# Altium project 12V_IdealDiode_PowerSupply_v1.PrjPcb
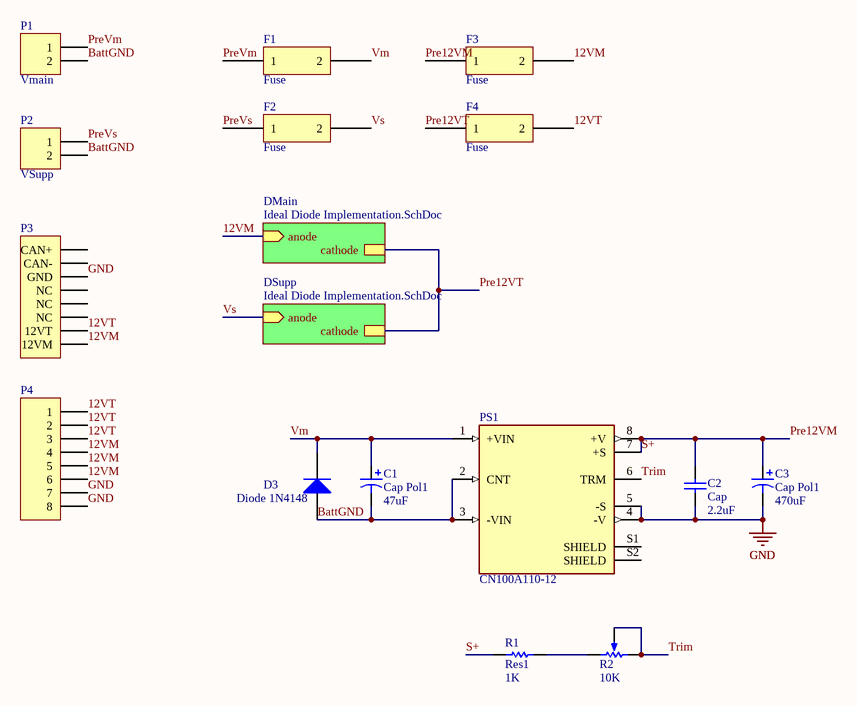
[diagram p0: 12V_IdealDiode_PowerSupply_v1.SchDoc]
2 sheets, 25 parts. Net scope: hierarchical (ports join the sheet entries above them; power ports are global).
Board file: 12V_IdealDiode_PowerSupply_v1.PcbDoc
Sheets:
  12V_IdealDiode_PowerSupply_v1.SchDoc
    DMain = Ideal Diode Implementation.SchDoc
    DSupp = Ideal Diode Implementation.SchDoc

## Sheet 12V_IdealDiode_PowerSupply_v1.SchDoc
size A; SheetNumber: 1; SheetTotal: 2

### Parts
C1  Cap Pol1  value 47uF  [RB7.6-15]
C2  Cap  value 2.2uF  [RAD-0.3]
C3  Cap Pol1  value 470uF  [RB7.6-15]
D3  Diode 1N4148  [DO-35]
F1  Fuse  [Fuse Hilder]
F2  Fuse  [Fuse Hilder]
F3  Fuse  [Fuse Hilder]
F4  Fuse  [Fuse Hilder]
P1  Vmain  [HDR1X2H]
P2  VSupp  [HDR1X2H]
P3  Header 8  [HDR1X8]  (value not drawn)
P4  Header 8  [HDR1X8]  (value not drawn)
PS1  CN100A110-12  [CONV_CN100A110-12]
R1  Res1  value 1K  [AXIAL-0.3]
R2  value 10K  [POT OFFSET 100_1]  (hidden comment: RPot_2)

### Sub-sheets
DMain = Ideal Diode Implementation.SchDoc: anode (in), cathode
DSupp = Ideal Diode Implementation.SchDoc: anode (in), cathode

### Nets
GND: C2.1 C3.2 P3.3(GND) P4.7 P4.8 PS1.4(-V) PS1.5(-S)
12VM: F3.2 P3.8(12VM) P4.4 P4.5 P4.6 ; sheet DMain/anode
12VT: F4.2 P3.7(12VT) P4.1 P4.2 P4.3
BattGND: C1.2 D3.1(A) P1.2 P2.2 PS1.2(CNT) PS1.3(-VIN)
Pre12VM: C2.2 C3.1 F3.1 PS1.7(+S) PS1.8(+V) R1.1  [also labelled S+]
Pre12VT: F4.1 ; sheet DMain/cathode, sheet DSupp/cathode
PreVm: F1.1 P1.1
PreVs: F2.1 P2.1
Trim: PS1.6(TRM) R2.1(TOP) R2.2(TAP)
Vm: C1.1 D3.2(K) F1.2 PS1.1(+VIN)
Vs: F2.2 ; sheet DSupp/anode
NetR1_2: R1.2 R2.3(BOT)

Not connected (* = marked no-connect by the designer): P3 1(CAN+) 2(CAN-) 4(NC) 5(NC) 6(NC); PS1 S1(SHIELD) S2(SHIELD)

### Library data of the parts
C1 C3 = Cap Pol1: Polarized Capacitor (Radial); Published: 8-Jun-2000; LatestRevisionDate: 17-Jul-2002; LatestRevisionNote: Re-released for DXP Platform.; PackageReference: RB7.6-15; Publisher: Altium Limited; PackageDescription: Polarized Capacitor (Radial); 2 Leads
C2 = Cap: Ceramic Capacitor; Published: 8-Jun-2000; LatestRevisionDate: 17-Jul-2002; LatestRevisionNote: Re-released for DXP Platform.; PackageReference: RAD-0.3; Publisher: Altium Limited; PackageDescription: Radial Cap, Thru-Hole; 2 Leads; 0.3 in Pin Spacing
D3 = Diode 1N4148: High Conductance Fast Diode; Published: 8-Jun-2000; LatestRevisionDate: 17-Jul-2002; LatestRevisionNote: Re-released for DXP Platform.; DatasheetVersion: 1997; PackageReference: DO-35; Publisher: Altium Limited; PackageDescription: Diode, Axial; Body 3.8 x 1.9 mm (LxDia. max), Lead Dia. 0.53 mm (max); Code_JEDEC: DO-204-AH; ComponentLink1Description: Manufacturer Link; ComponentLink1URL: http://www.fairchildsemi.com/; ComponentLink2Description: Datasheet; ComponentLink2URL: http://www.fairchildsemi.com/ds/1N%2F1N4148.pdf
P1 P2 = Header 2H: Header, 2-Pin, Right Angle; LatestRevisionDate: 17-Jul-2002; LatestRevisionNote: Re-released for DXP Platform.; Publisher: Altium Limited
P3 P4 = Header 8: Header, 8-Pin; LatestRevisionDate: 17-Jul-2002; LatestRevisionNote: Re-released for DXP Platform.; Publisher: Altium Limited
PS1 = CN100A110-12: Isolated Module DC DC Converter 1 Output 12V - - 8.4A 60V - 160V Input; MF: TDK-Lambda Americas Inc; Price: None; Availability: In Stock; Check_prices: https://www.snapeda.com/parts/CN100A110-12/TDK-Lambda+Americas+Inc/view-part/?ref=eda; Value: *; MP: CN100A110-12; Package: DIP-9 TDK-Lambda Americas Inc; Purchase-URL: https://pricing.snapeda.com/search/part/CN100A110-12/?ref=eda; SnapEDA_Link: https://www.snapeda.com/parts/CN100A110-12/TDK-Lambda+Americas+Inc/view-part/?ref=snap
R1 = Res1: Resistor; Published: 8-Jun-2000; LatestRevisionDate: 17-Jul-2002; LatestRevisionNote: Re-released for DXP Platform.; PackageReference: AXIAL-0.3; Publisher: Altium Limited; PackageDescription: Axial Device, Thru-Hole; 2 Leads; 0.3 in Pin Spacing
R2 = RPot_5: Potentiometer; Sim Note: Enter the Resistance value and the set point into parameter fields.; Set Position: 0.5; Published: 8-Jun-2000; LatestRevisionDate: 17-Jul-2002; LatestRevisionNote: Re-released for DXP Platform.; PackageReference: VR5; Publisher: Altium Limited; PackageDescription: Variable Resistor, Thru-Hole; 3 Leads

## Sheet Ideal Diode Implementation.SchDoc
size A; SheetNumber: 2; SheetTotal: 2
Used 2 times, as channels DMain, DSupp. Parts and nets are listed once, with the designators drawn on the sheet.
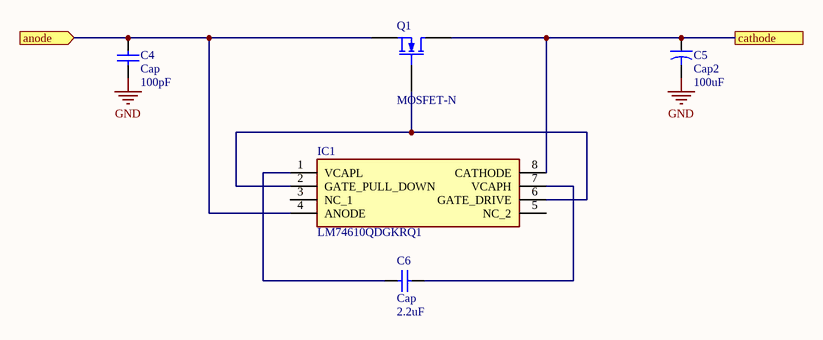
[diagram p1: Ideal Diode Implementation.SchDoc]

### Parts
C4  Cap  value 100pF  [RAD-0.3]
C5  Cap2  value 100uF  [CAPR5-4X5]
C6  Cap  value 2.2uF  [RAD-0.3]
IC1  LM74610QDGKRQ1  [SOP65P490X110-8N]
Q1  MOSFET-N  [E3]

### Ports
anode (in), cathode

### Nets
GND: C4.1 C5.2
anode: C4.2 IC1.4(ANODE) Q1.3(S) ; port anode
cathode: C5.1 IC1.8(CATHODE) Q1.1(D) ; port cathode
NetC6_1: C6.1 IC1.1(VCAPL)
NetC6_2: C6.2 IC1.7(VCAPH)
NetIC1_2: IC1.2(GATE_PULL_DOWN) IC1.6(GATE_DRIVE) Q1.2(G)

Not connected (* = marked no-connect by the designer): IC1 3(NC_1) 5(NC_2)

### Channels
DMain: designators end in _DMain; ports anode=12VM cathode=Pre12VT
DSupp: designators end in _DSupp; ports anode=Vs cathode=Pre12VT

### Library data of the parts
C4 C6 = Cap: Capacitor; Published: 8-Jun-2000; LatestRevisionDate: 17-Jul-2002; LatestRevisionNote: Re-released for DXP Platform.; PackageReference: RAD-0.3; Publisher: Altium Limited; PackageDescription: Radial Cap, Thru-Hole; 2 Leads; 0.3 in Pin Spacing
C5 = Cap2: Capacitor; Published: 23-Sep-2002; PackageReference: CAPR5-4X5; Publisher: Altium Limited; PackageDescription: Capacitor; 2 Leads
IC1 = LM74610QDGKRQ1: Integrated Circuit; Manufacturer_Name: Texas Instruments; Datasheet Link: http://www.ti.com/lit/gpn/lm74610-q1; Height: 1.1mm; Manufacturer_Part_Number: LM74610QDGKRQ1; Mouser Part Number: 595-LM74610QDGKRQ1; Mouser Price/Stock: https://www.mouser.co.uk/ProductDetail/Texas-Instruments/LM74610QDGKRQ1?qs=3jdCaFhktOQTVpuuubgDqg%3D%3D; Arrow Part Number: LM74610QDGKRQ1; Arrow Price/Stock: https://www.arrow.com/en/products/lm74610qdgkrq1/texas-instruments
Q1 = MOSFET-N: N-Channel MOSFET; Published: 8-Jun-2000; LatestRevisionDate: 17-Jul-2002; LatestRevisionNote: Re-released for DXP Platform.; PackageVersion: 1995/1996; PackageReference: E3; Publisher: Altium Limited; PackageDescription: TO, Flat Index; 3 In-Line, Axial Leads; Body Dia. 4.6mm; Lead Dia. 0.5 mm (max)

## Nets that join several sheets
GND: 12V_IdealDiode_PowerSupply_v1 (7 pins), DMain (C4_DMain.1 C5_DMain.2), DSupp (C4_DSupp.1 C5_DSupp.2)
12VM: 12V_IdealDiode_PowerSupply_v1 (5 pins), DMain (C4_DMain.2 IC1_DMain.4 Q1_DMain.3)
Pre12VT: 12V_IdealDiode_PowerSupply_v1 (F4.1), DMain (C5_DMain.1 IC1_DMain.8 Q1_DMain.1), DSupp (C5_DSupp.1 IC1_DSupp.8 Q1_DSupp.1)
Vs: 12V_IdealDiode_PowerSupply_v1 (F2.2), DSupp (C4_DSupp.2 IC1_DSupp.4 Q1_DSupp.3)